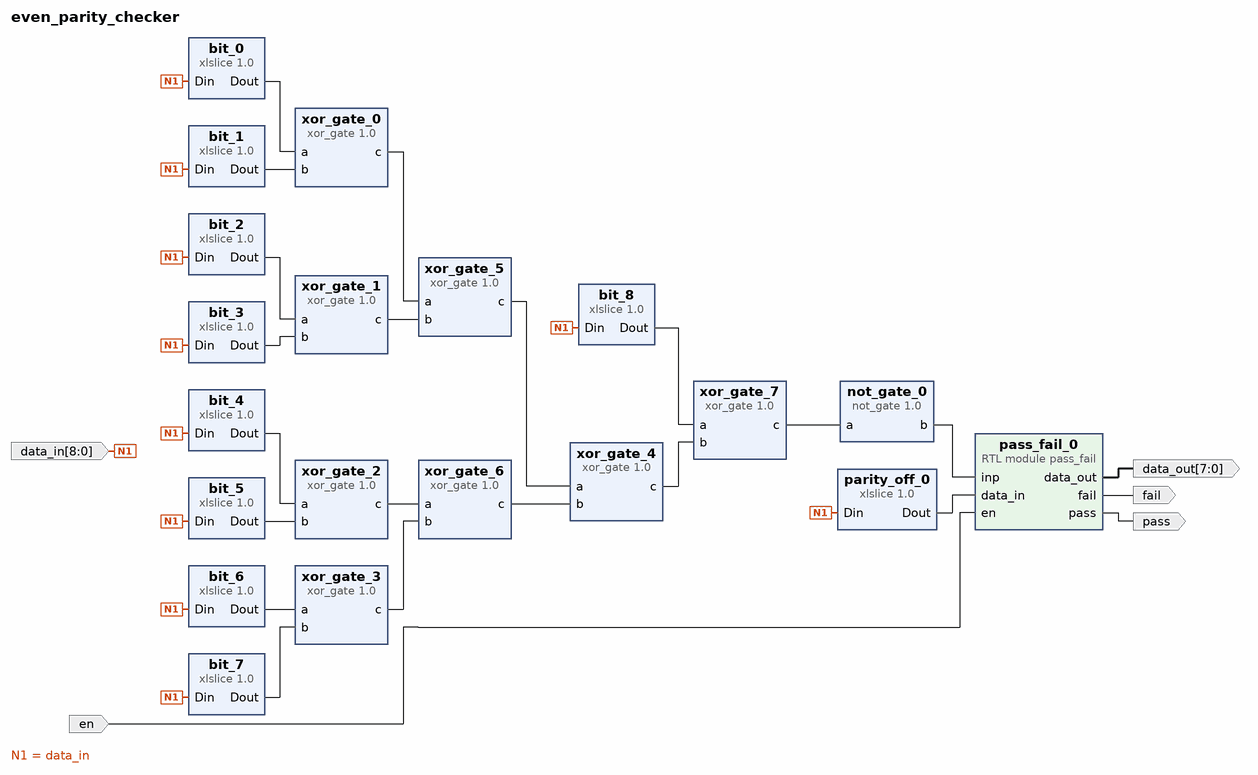
[diagram p0: block diagram of the top level]
# Vivado block design even_parity_checker, xc7z020clg400-1, Vivado 2024.2
create_bd_design even_parity_checker

create_bd_port -dir O -from 7 -to 0 data_out
create_bd_port -dir O fail
create_bd_port -dir O pass
create_bd_port -dir I -from 8 -to 0 data_in
create_bd_port -dir I en

create_bd_cell -type ip -vlnv user.org:user:xor_gate:1.0 xor_gate_0
create_bd_cell -type ip -vlnv user.org:user:xor_gate:1.0 xor_gate_1
create_bd_cell -type ip -vlnv user.org:user:xor_gate:1.0 xor_gate_2
create_bd_cell -type ip -vlnv user.org:user:xor_gate:1.0 xor_gate_3
create_bd_cell -type ip -vlnv user.org:user:xor_gate:1.0 xor_gate_4
create_bd_cell -type ip -vlnv user.org:user:xor_gate:1.0 xor_gate_5
create_bd_cell -type ip -vlnv user.org:user:xor_gate:1.0 xor_gate_6
create_bd_cell -type module -reference pass_fail pass_fail_0
create_bd_cell -type ip -vlnv user.org:user:not_gate:1.0 not_gate_0
create_bd_cell -type ip -vlnv user.org:user:xor_gate:1.0 xor_gate_7
create_bd_cell -type ip -vlnv xilinx.com:ip:xlslice:1.0 bit_0
set_property -dict {CONFIG.DIN_WIDTH 9} [get_bd_cells bit_0]
create_bd_cell -type ip -vlnv xilinx.com:ip:xlslice:1.0 bit_1
set_property -dict {CONFIG.DIN_FROM 1 CONFIG.DIN_TO 1 CONFIG.DIN_WIDTH 9} [get_bd_cells bit_1]
create_bd_cell -type ip -vlnv xilinx.com:ip:xlslice:1.0 bit_2
set_property -dict {CONFIG.DIN_FROM 2 CONFIG.DIN_TO 2 CONFIG.DIN_WIDTH 9} [get_bd_cells bit_2]
create_bd_cell -type ip -vlnv xilinx.com:ip:xlslice:1.0 bit_3
set_property -dict {CONFIG.DIN_FROM 3 CONFIG.DIN_TO 3 CONFIG.DIN_WIDTH 9} [get_bd_cells bit_3]
create_bd_cell -type ip -vlnv xilinx.com:ip:xlslice:1.0 bit_4
set_property -dict {CONFIG.DIN_FROM 4 CONFIG.DIN_TO 4 CONFIG.DIN_WIDTH 9} [get_bd_cells bit_4]
create_bd_cell -type ip -vlnv xilinx.com:ip:xlslice:1.0 bit_5
set_property -dict {CONFIG.DIN_FROM 5 CONFIG.DIN_TO 5 CONFIG.DIN_WIDTH 9} [get_bd_cells bit_5]
create_bd_cell -type ip -vlnv xilinx.com:ip:xlslice:1.0 bit_6
set_property -dict {CONFIG.DIN_FROM 6 CONFIG.DIN_TO 6 CONFIG.DIN_WIDTH 9} [get_bd_cells bit_6]
create_bd_cell -type ip -vlnv xilinx.com:ip:xlslice:1.0 bit_7
set_property -dict {CONFIG.DIN_FROM 7 CONFIG.DIN_TO 7 CONFIG.DIN_WIDTH 9} [get_bd_cells bit_7]
create_bd_cell -type ip -vlnv xilinx.com:ip:xlslice:1.0 bit_8
set_property -dict {CONFIG.DIN_FROM 8 CONFIG.DIN_TO 8 CONFIG.DIN_WIDTH 9} [get_bd_cells bit_8]
create_bd_cell -type ip -vlnv xilinx.com:ip:xlslice:1.0 parity_off_0
set_property -dict {CONFIG.DIN_FROM 8 CONFIG.DIN_TO 1 CONFIG.DIN_WIDTH 9} [get_bd_cells parity_off_0]

# ---- connections ----

connect_bd_net [get_bd_pins bit_0/Dout] [get_bd_pins xor_gate_0/a]
connect_bd_net [get_bd_pins bit_1/Dout] [get_bd_pins xor_gate_0/b]
connect_bd_net [get_bd_pins bit_2/Dout] [get_bd_pins xor_gate_1/a]
connect_bd_net [get_bd_pins bit_3/Dout] [get_bd_pins xor_gate_1/b]
connect_bd_net [get_bd_pins bit_4/Dout] [get_bd_pins xor_gate_2/a]
connect_bd_net [get_bd_pins bit_5/Dout] [get_bd_pins xor_gate_2/b]
connect_bd_net [get_bd_pins bit_6/Dout] [get_bd_pins xor_gate_3/a]
connect_bd_net [get_bd_pins bit_7/Dout] [get_bd_pins xor_gate_3/b]
connect_bd_net [get_bd_pins bit_8/Dout] [get_bd_pins xor_gate_7/a]
connect_bd_net -net data_1 [get_bd_ports data_in] \
  [get_bd_pins bit_0/Din] [get_bd_pins bit_1/Din] [get_bd_pins bit_2/Din] [get_bd_pins bit_3/Din] [get_bd_pins bit_4/Din] \
  [get_bd_pins bit_5/Din] [get_bd_pins bit_6/Din] [get_bd_pins bit_7/Din] [get_bd_pins bit_8/Din] \
  [get_bd_pins parity_off_0/Din]
connect_bd_net -net en_0_1 [get_bd_ports en] [get_bd_pins pass_fail_0/en]
connect_bd_net [get_bd_pins not_gate_0/b] [get_bd_pins pass_fail_0/inp]
connect_bd_net [get_bd_pins parity_off_0/Dout] [get_bd_pins pass_fail_0/data_in]
connect_bd_net [get_bd_pins pass_fail_0/data_out] [get_bd_ports data_out]
connect_bd_net [get_bd_pins pass_fail_0/fail] [get_bd_ports fail]
connect_bd_net [get_bd_pins pass_fail_0/pass] [get_bd_ports pass]
connect_bd_net [get_bd_pins xor_gate_0/c] [get_bd_pins xor_gate_5/a]
connect_bd_net [get_bd_pins xor_gate_1/c] [get_bd_pins xor_gate_5/b]
connect_bd_net [get_bd_pins xor_gate_2/c] [get_bd_pins xor_gate_6/a]
connect_bd_net [get_bd_pins xor_gate_3/c] [get_bd_pins xor_gate_6/b]
connect_bd_net [get_bd_pins xor_gate_4/c] [get_bd_pins xor_gate_7/b]
connect_bd_net [get_bd_pins xor_gate_5/c] [get_bd_pins xor_gate_4/a]
connect_bd_net [get_bd_pins xor_gate_6/c] [get_bd_pins xor_gate_4/b]
connect_bd_net -net xor_gate_8_c [get_bd_pins xor_gate_7/c] [get_bd_pins not_gate_0/a]

validate_bd_design
save_bd_design
